# Altium schematic sheet 6_Analog.SchDoc
size A3; DocumentNumber: 6; SheetNumber: 6; SheetTotal: 6
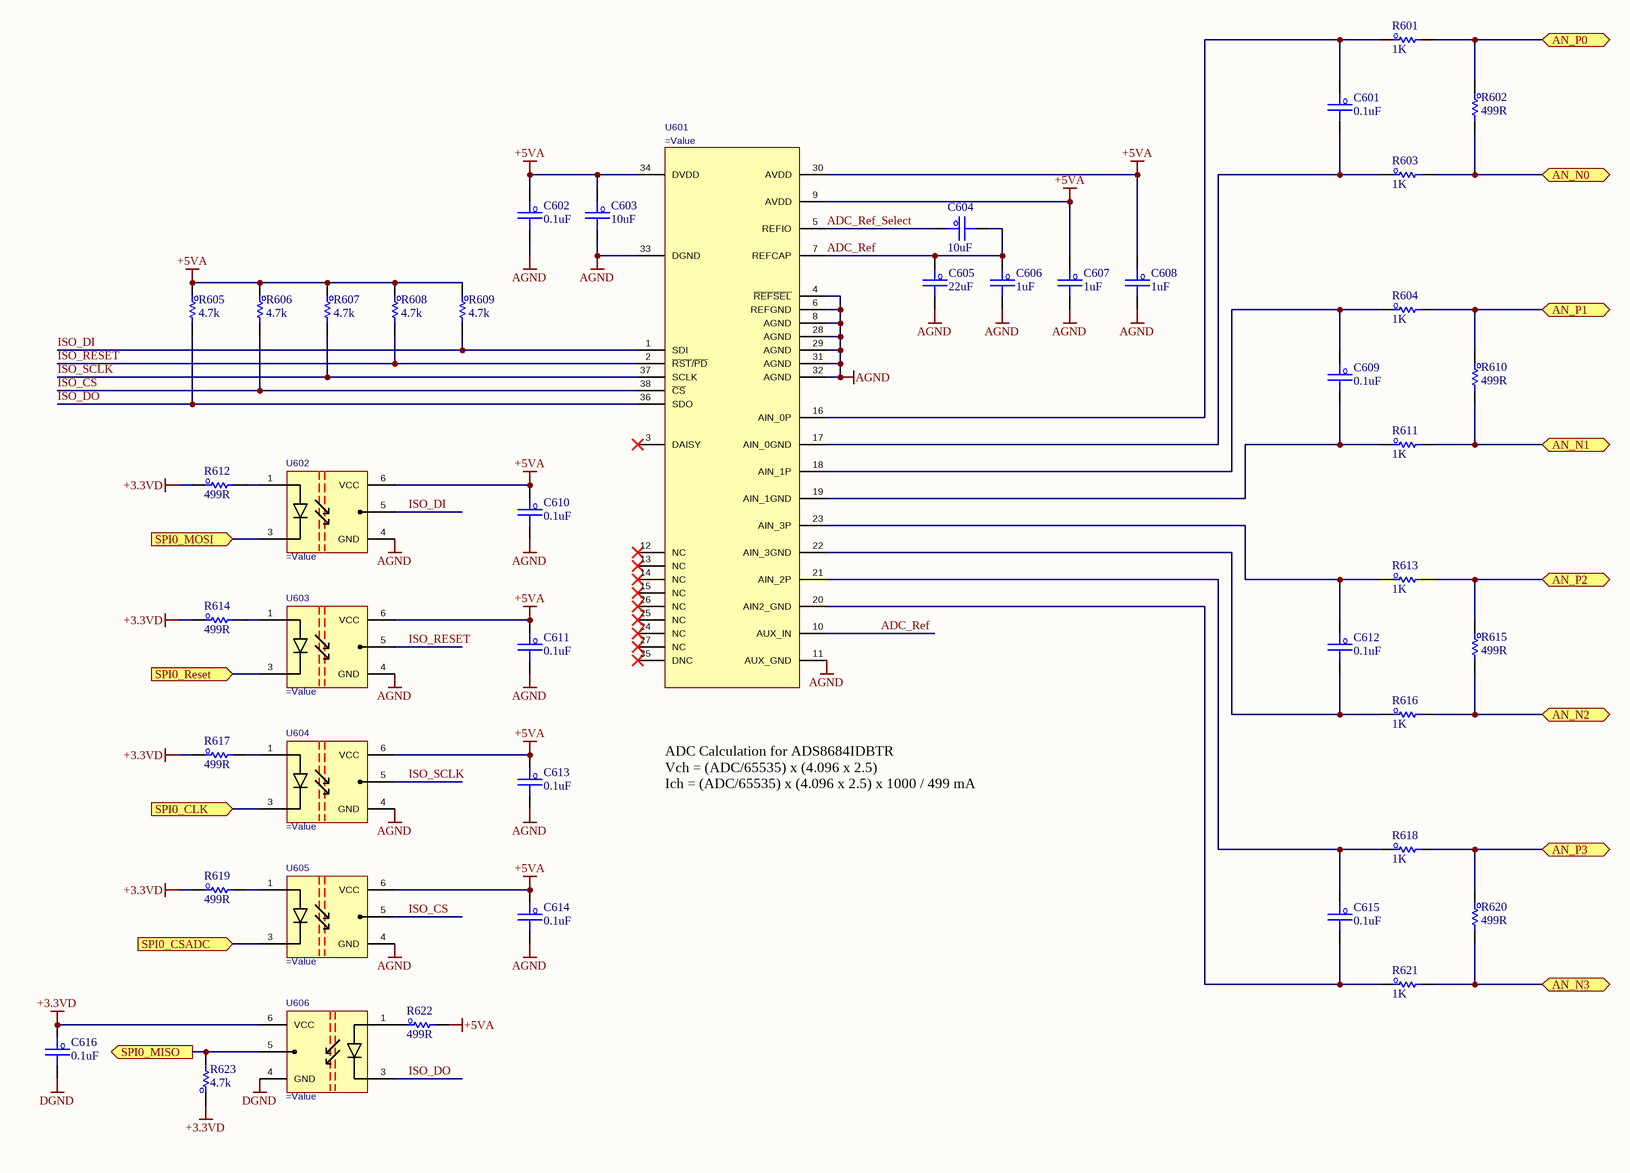
[diagram p0: 6_Analog.SchDoc]

## Parts
C601  0.1uF  [C_0603]
C602  0.1uF  [C_0603]
C603  10uF  [C_0603]
C604  10uF  [C_0603]
C605  22uF  [C_0603]
C606  1uF  [C_0603]
C607  1uF  [C_0603]
C608  1uF  [C_0603]
C609  0.1uF  [C_0603]
C610  0.1uF  [C_0603]
C611  0.1uF  [C_0603]
C612  0.1uF  [C_0603]
C613  0.1uF  [C_0603]
C614  0.1uF  [C_0603]
C615  0.1uF  [C_0603]
C616  0.1uF  [C_0603]
R601  1K  [R_0603]
R602  499R  [R_0603]
R603  1K  [R_0603]
R604  1K  [R_0603]
R605  4.7k  [R_0603]
R606  4.7k  [R_0603]
R607  4.7k  [R_0603]
R608  4.7k  [R_0603]
R609  4.7k  [R_0603]
R610  499R  [R_0603]
R611  1K  [R_0603]
R612  499R  [R_0603]
R613  1K  [R_0603]
R614  499R  [R_0603]
R615  499R  [R_0603]
R616  1K  [R_0603]
R617  499R  [R_0603]
R618  1K  [R_0603]
R619  499R  [R_0603]
R620  499R  [R_0603]
R621  1K  [R_0603]
R622  499R  [R_0603]
R623  4.7k  [R_0603]
U601  (no value)  [DBT0038A_N_TEX]
U602  (no value)  [5PIN SO6_TOS]
U603  (no value)  [5PIN SO6_TOS]
U604  (no value)  [5PIN SO6_TOS]
U605  (no value)  [5PIN SO6_TOS]
U606  (no value)  [5PIN SO6_TOS]

## Ports
AN_N0 (bidir), AN_N1 (bidir), AN_N2 (bidir), AN_N3 (bidir), AN_P0 (bidir), AN_P1 (bidir), AN_P2 (bidir), AN_P3 (bidir), SPI0_CLK (in), SPI0_CSADC (in), SPI0_MISO (out), SPI0_MOSI (in), SPI0_Reset (in)

## Nets
+3.3VD: C616.1 R612.1 R614.1 R617.1 R619.1 R623.1 U606.6(VCC)
+5VA: C602.1 C603.1 C607.1 C608.1 C610.1 C611.1 C613.1 C614.1 R605.1 R606.1 R607.1 R608.1 R609.1 R622.2 U601.9(AVDD) U601.30(AVDD) U601.34(DVDD) U602.6(VCC) U603.6(VCC) U604.6(VCC) U605.6(VCC)
AGND: C602.2 C603.2 C605.2 C606.2 C607.2 C608.2 C610.2 C611.2 C613.2 C614.2 U601.4(~{REFSEL}) U601.6(REFGND) U601.8(AGND) U601.11(AUX_GND) U601.28(AGND) U601.29(AGND) U601.31(AGND) U601.32(AGND) U601.33(DGND) U602.4(GND) U603.4(GND) U604.4(GND) U605.4(GND)
DGND: C616.2 U606.4(GND)
ADC_Ref: C604.2 C605.1 C606.1 U601.7(REFCAP) U601.10(AUX_IN)
ADC_Ref_Select: C604.1 U601.5(REFIO)
AN_N0: R602.2 R603.2 ; port AN_N0
AN_N1: R610.2 R611.2 ; port AN_N1
AN_N2: R615.2 R616.2 ; port AN_N2
AN_N3: R620.2 R621.2 ; port AN_N3
AN_P0: R601.2 R602.1 ; port AN_P0
AN_P1: R604.2 R610.1 ; port AN_P1
AN_P2: R613.2 R615.1 ; port AN_P2
AN_P3: R618.2 R620.1 ; port AN_P3
ISO_CS: R606.2 U601.38(~{CS}) U605.5(O1)
ISO_DI: R609.2 U601.1(SDI) U602.5(O1)
ISO_DO: R605.2 U601.36(SDO) U606.3(A)
ISO_RESET: R608.2 U601.2(~{RST}/~{PD}) U603.5(O1)
ISO_SCLK: R607.2 U601.37(SCLK) U604.5(O1)
SPI0_CLK: U604.3(A) ; port SPI0_CLK
SPI0_CSADC: U605.3(A) ; port SPI0_CSADC
SPI0_MISO: R623.2 U606.5(O1) ; port SPI0_MISO
SPI0_MOSI: U602.3(A) ; port SPI0_MOSI
SPI0_Reset: U603.3(A) ; port SPI0_Reset
NetC601_1: C601.1 R601.1 U601.16(AIN_0P)
NetC601_2: C601.2 R603.1 U601.17(AIN_0GND)
NetC609_1: C609.1 R604.1 U601.18(AIN_1P)
NetC609_2: C609.2 R611.1 U601.19(AIN_1GND)
NetC612_1: C612.1 R613.1 U601.23(AIN_3P)
NetC612_2: C612.2 R616.1 U601.22(AIN_3GND)
NetC615_1: C615.1 R618.1 U601.21(AIN_2P)
NetC615_2: C615.2 R621.1 U601.20(AIN2_GND)
NetR612_2: R612.2 U602.1(A)
NetR614_2: R614.2 U603.1(A)
NetR617_2: R617.2 U604.1(A)
NetR619_2: R619.2 U605.1(A)
NetR622_1: R622.1 U606.1(A)

Not connected (* = marked no-connect by the designer): U601 3(DAISY)* 12(NC)* 13(NC)* 14(NC)* 15(NC)* 24(NC)* 25(NC)* 26(NC)* 27(NC)* 35(DNC)*

## Notes on the sheet
- ADC Calculation for ADS8684IDBTR
  Vch = (ADC/65535) x (4.096 x 2.5)
  Ich = (ADC/65535) x (4.096 x 2.5) x 1000 / 499 mA
- Title :
- Revision :
- ผู้จัดทำ:
- Size:
- A3
- Time:
- ผู้เขียน:
- บริษัท ยูนิเวอร์แซล ยูทีลิตี้ส์ จำกัด (มหาชน) เลขที่ 1 อาคาร อีสท์วอเตอร์ ชั้น 18 ซอยวิภาวดีรังสิต 5 แขวงจอมพล เขตจตุจักร กรุงเทพฯ 10900
  Tel : +662-272-1688
  Fax :+662-2721690-1
- -
- Sheet:
- of
- ผู้อำนวยการ
- ผู้ตรวจสอบ:
- Number:
- กรรมการผู้จัดการ:
- File:

## Library data of the parts
C601 C602 C609-C616 = C_Capacitor: CAP CER 0.1UF 50V X7R 0603; Manufacturer: KEMET; PartNumber: C0603C104K5RACTU; PackageReference: 0603; PartID: 399-5089-1-ND; Value2: 50V; Value: 0.1uF; Value3: *
C603 C604 = C_Capacitor: CAP CER 10UF 10V X6S 0603; Manufacturer: Murata Electronics; PartNumber: GRT188C81A106ME13D; PackageReference: 0603; PartID: 490-12283-1-ND; Value2: 10V; Value: 10uF; Value3: *
C605 = C_Capacitor: CAP CER 22UF 10V X5R 0603; Manufacturer: Murata Electronics; PartNumber: GRM187R61A226ME15D; PackageReference: 0603; PartID: 490-13243-1-ND; Value2: 10V; Value: 22uF; Value3: *
C606-C608 = C_Capacitor: CAP CER 1UF 50V X5R 0603; Manufacturer: Murata Electronics; PartNumber: GRT188R61H105KE13D; PackageReference: 0603; PartID: 490-12330-1-ND; Value2: 50V; Value: 1uF; Value3: *
R601 R603 R604 R611 R613 R616 R618 R621 = R_Resister: RES SMD 1K OHM 5% 1/10W 0603; Manufacturer: Vishay Dale; PartNumber: CRCW06031K00JNEA; Value2: 0.1W; Value: 1K; PackageReference: 0603; PartID: 541-1.0KGCT-ND; Value3: *
R602 R610 R615 R620 = R_Resister: RES SMD 499 OHM 1% 1/3W 0603; Manufacturer: Vishay Dale; PartNumber: CRCW0603499RFKEAHP; Value2: 0.333W; Value: 499R; PackageReference: 0603; PartID: 541-499SCT-ND; Value3: *
R605-R609 R623 = R_Resister: RES 4.7K OHM 5% 1/10W 0603; Manufacturer: Vishay Dale; PartNumber: CRCW06034K70JNEBC; Value2: 0.1W; Value: 4.7k; PackageReference: 0603; PartID: 541-CRCW06034K70JNEBCCT-ND; Value3: *
R612 R614 R617 R619 R622 = R_Resister: RES 499 OHM 1% 1/10W 0603; Manufacturer: Vishay Dale; PartNumber: CRCW0603499RFKEAC; Value2: 0.1W; Value: 499R; PackageReference: 0603; PartID: 541-3986-1-ND; Value3: *
U601 = IC_ADC_ADS8684IDBTR: IC ADC 16BIT SAR 38TSSOP; Manufacturer: Texas Instruments; Value3: TIPD166; Value: ADS8684IDBTR; PackageReference: 38-TSSOP; PartID: 296-39875-1-ND; PartNumber: ADS8684IDBTR
U602-U606 = IC_OPTO_TLP109(TPR,E): OPTOISO 5KV PUSH PULL SO6L; Manufacturer: Toshiba Semiconductor and Storage; Value: TLP2362(TPL,E(T; PackageReference: SO-6; PartID: C37658; PartNumber: TLP2362(TPL,E(T; Value2: TLP2362(TPL,E(T; Value3: TLP109(TPR,E)